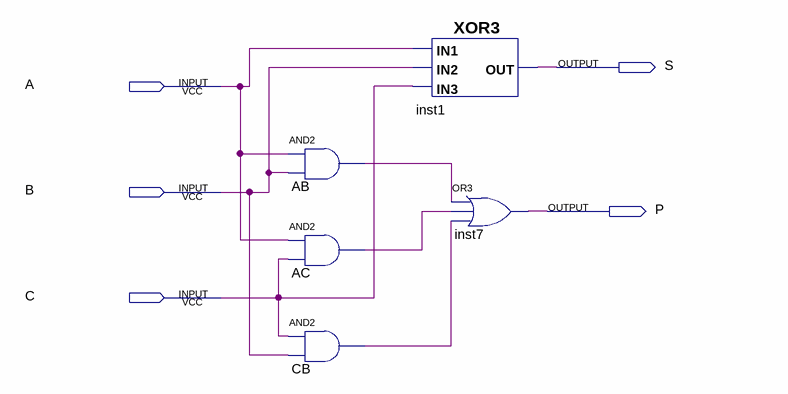
[diagram p0: schematic sheet]
// Quartus schematic obfa.bdf as structural Verilog: 5 symbols, 5 pins
module obfa (
  input  A,
  input  B,
  input  C,
  output S,
  output P
);

  wire AB_out, AC_out, CB_out;

  and AB (AB_out, A, B);
  and AC (AC_out, A, C);
  and CB (CB_out, C, B);
  XOR3 inst1 (.IN3(C), .IN1(A), .IN2(B), .OUT(S));
  or inst7 (P, AB_out, AC_out, CB_out);
endmodule
